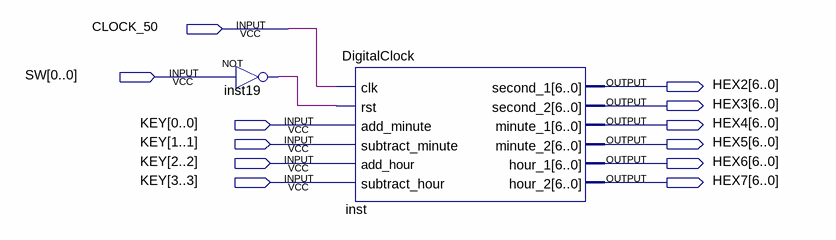
[diagram p0: schematic sheet]
// Quartus schematic block_digital_clock.bdf as structural Verilog: 2 symbols, 12 pins
module block_digital_clock (
  input  CLOCK_50,
  input  [0:0] SW,
  input  [3:0] KEY,
  output [6:0] HEX2,
  output [6:0] HEX3,
  output [6:0] HEX4,
  output [6:0] HEX5,
  output [6:0] HEX6,
  output [6:0] HEX7
);

  wire inst19_out;

  not inst19 (inst19_out, SW[0]);
  DigitalClock inst (
    .clk(CLOCK_50), .rst(inst19_out), .add_minute(KEY[0]), .subtract_minute(KEY[1]), .add_hour(KEY[2]),
    .subtract_hour(KEY[3]), .second_1(HEX2), .second_2(HEX3), .minute_1(HEX4), .minute_2(HEX5),
    .hour_1(HEX6), .hour_2(HEX7));
endmodule
